# EAGLE design TSST8 (EAGLE 7.3.0)
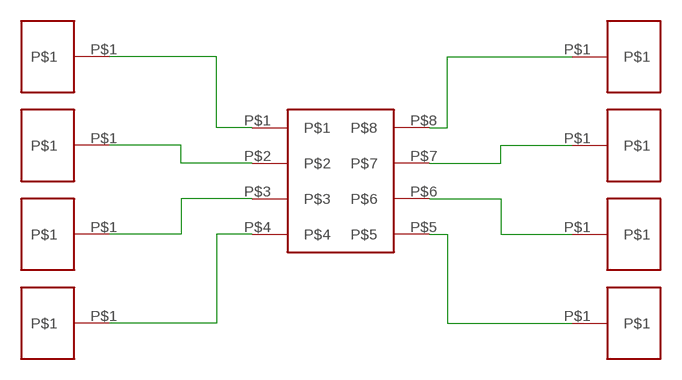
[diagram p0: schematic, sheet 1]

## Parts
U$1  TSST8  [TSST8]
U$2  PAD50X100MIL  [100X50MIL_PAD]
U$3  PAD50X100MIL  [100X50MIL_PAD]
U$4  PAD50X100MIL  [100X50MIL_PAD]
U$5  PAD50X100MIL  [100X50MIL_PAD]
U$6  PAD50X100MIL  [100X50MIL_PAD]
U$7  PAD50X100MIL  [100X50MIL_PAD]
U$8  PAD50X100MIL  [100X50MIL_PAD]
U$9  PAD50X100MIL  [100X50MIL_PAD]

## Nets
N$1: U$1.P$2 U$3.P$1
N$2: U$1.P$3 U$4.P$1
N$3: U$1.P$1 U$2.P$1
N$4: U$1.P$4 U$5.P$1
N$5: U$1.P$7 U$8.P$1
N$6: U$1.P$6 U$7.P$1
N$7: U$1.P$8 U$9.P$1
N$8: U$1.P$5 U$6.P$1

## Library data of the parts
U$1 = generic_smd:TSST8
U$2-U$9 = generic_smd:PAD

## Board
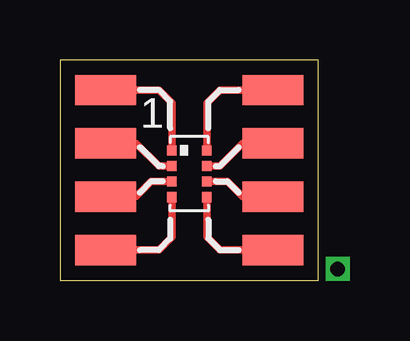
[diagram p1: board, top side]
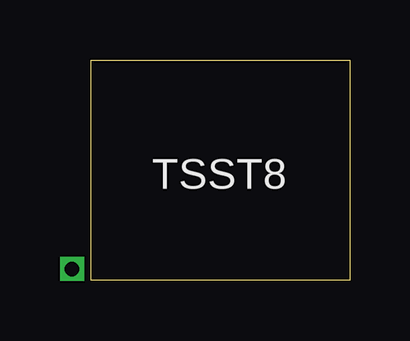
[diagram p2: board, bottom side, seen from below]

Size 10.78 x 9.2 mm. Coordinates in mm from the lower left corner, seen from the top.
Outline: 0,0 10.78,0 10.78,9.2 0,9.2 0,0
Copper layers (1*16): Top 0.035mm / dielectric 1.5mm / Bottom 0.035mm
Design rules "default": minimum track width 10mil, minimum drill 24mil, track to track 8mil, track to pad 8mil, pad to pad 8mil, via to via 8mil, smd to smd 8mil, copper to edge 40mil, drill to drill 8mil, minimum pad ring 10mil, minimum via ring 8mil, stop-mask expansion 4mil, vias tented up to drill 0mil, thermal gap 10mil

### Footprints (pad centres in the part's own frame; a part is rotated, then mirrored left to right if it is on the bottom)
TSST8 = smd 0.42 x 0.4: P$1 -0.975,-0.73; P$2 -0.325,-0.73; P$3 0.325,-0.73; P$4 0.975,-0.73; P$5 0.975,0.73; P$6 0.325,0.73; P$7 -0.325,0.73; P$8 -0.975,0.73
100X50MIL_PAD = smd 1.27 x 2.54: P$1 0,0

### Placement (x,y rotation side)
U$1  5.4,4.45 270 top
U$2  1.91,7.94 90 top
U$3  1.91,5.71 90 top
U$4  1.91,3.49 90 top
U$5  1.91,1.27 90 top
U$6  8.89,1.27 90 top
U$7  8.89,3.49 90 top
U$8  8.89,5.71 90 top
U$9  8.89,7.94 90 top

### Tracks (layer width: path | path; a pad name or v marks a point on that pad's centre or on a via)
N$1
  Top 0.305: U$3.P$1 3.17,5.71 4.13,4.76 U$1.P$2
N$2
  Top 0.305: U$1.P$3 3.8,4.12 3.17,3.49 U$4.P$1
N$3
  Top 0.305: U$1.P$1 4.67,7.4 4.13,7.94 U$2.P$1
N$4
  Top 0.305: U$1.P$4 4.67,1.81 4.13,1.27 U$5.P$1
N$5
  Top 0.305: U$1.P$7 6.67,4.77 7.62,5.71 U$8.P$1
N$6
  Top 0.305: U$1.P$6 6.99,4.12 7.62,3.49 U$7.P$1
N$7
  Top 0.305: U$1.P$8 6.13,7.4 6.67,7.94 U$9.P$1
N$8
  Top 0.305: U$1.P$5 6.13,1.81 6.67,1.27 U$6.P$1
N$9  (via drill 0.6)
  other vias: 11.59,0.48

### Text on the board
tPlace: 1
bPlace: TSST8
Document: via required to force drill file generation